# Altium schematic sheet 05_can_spi.SchDoc: =Proj_Title
size B; Address1: Giesshuebelstrasse 40; Address2: 8045 Zurich, Switzerland; SheetNumber: 5
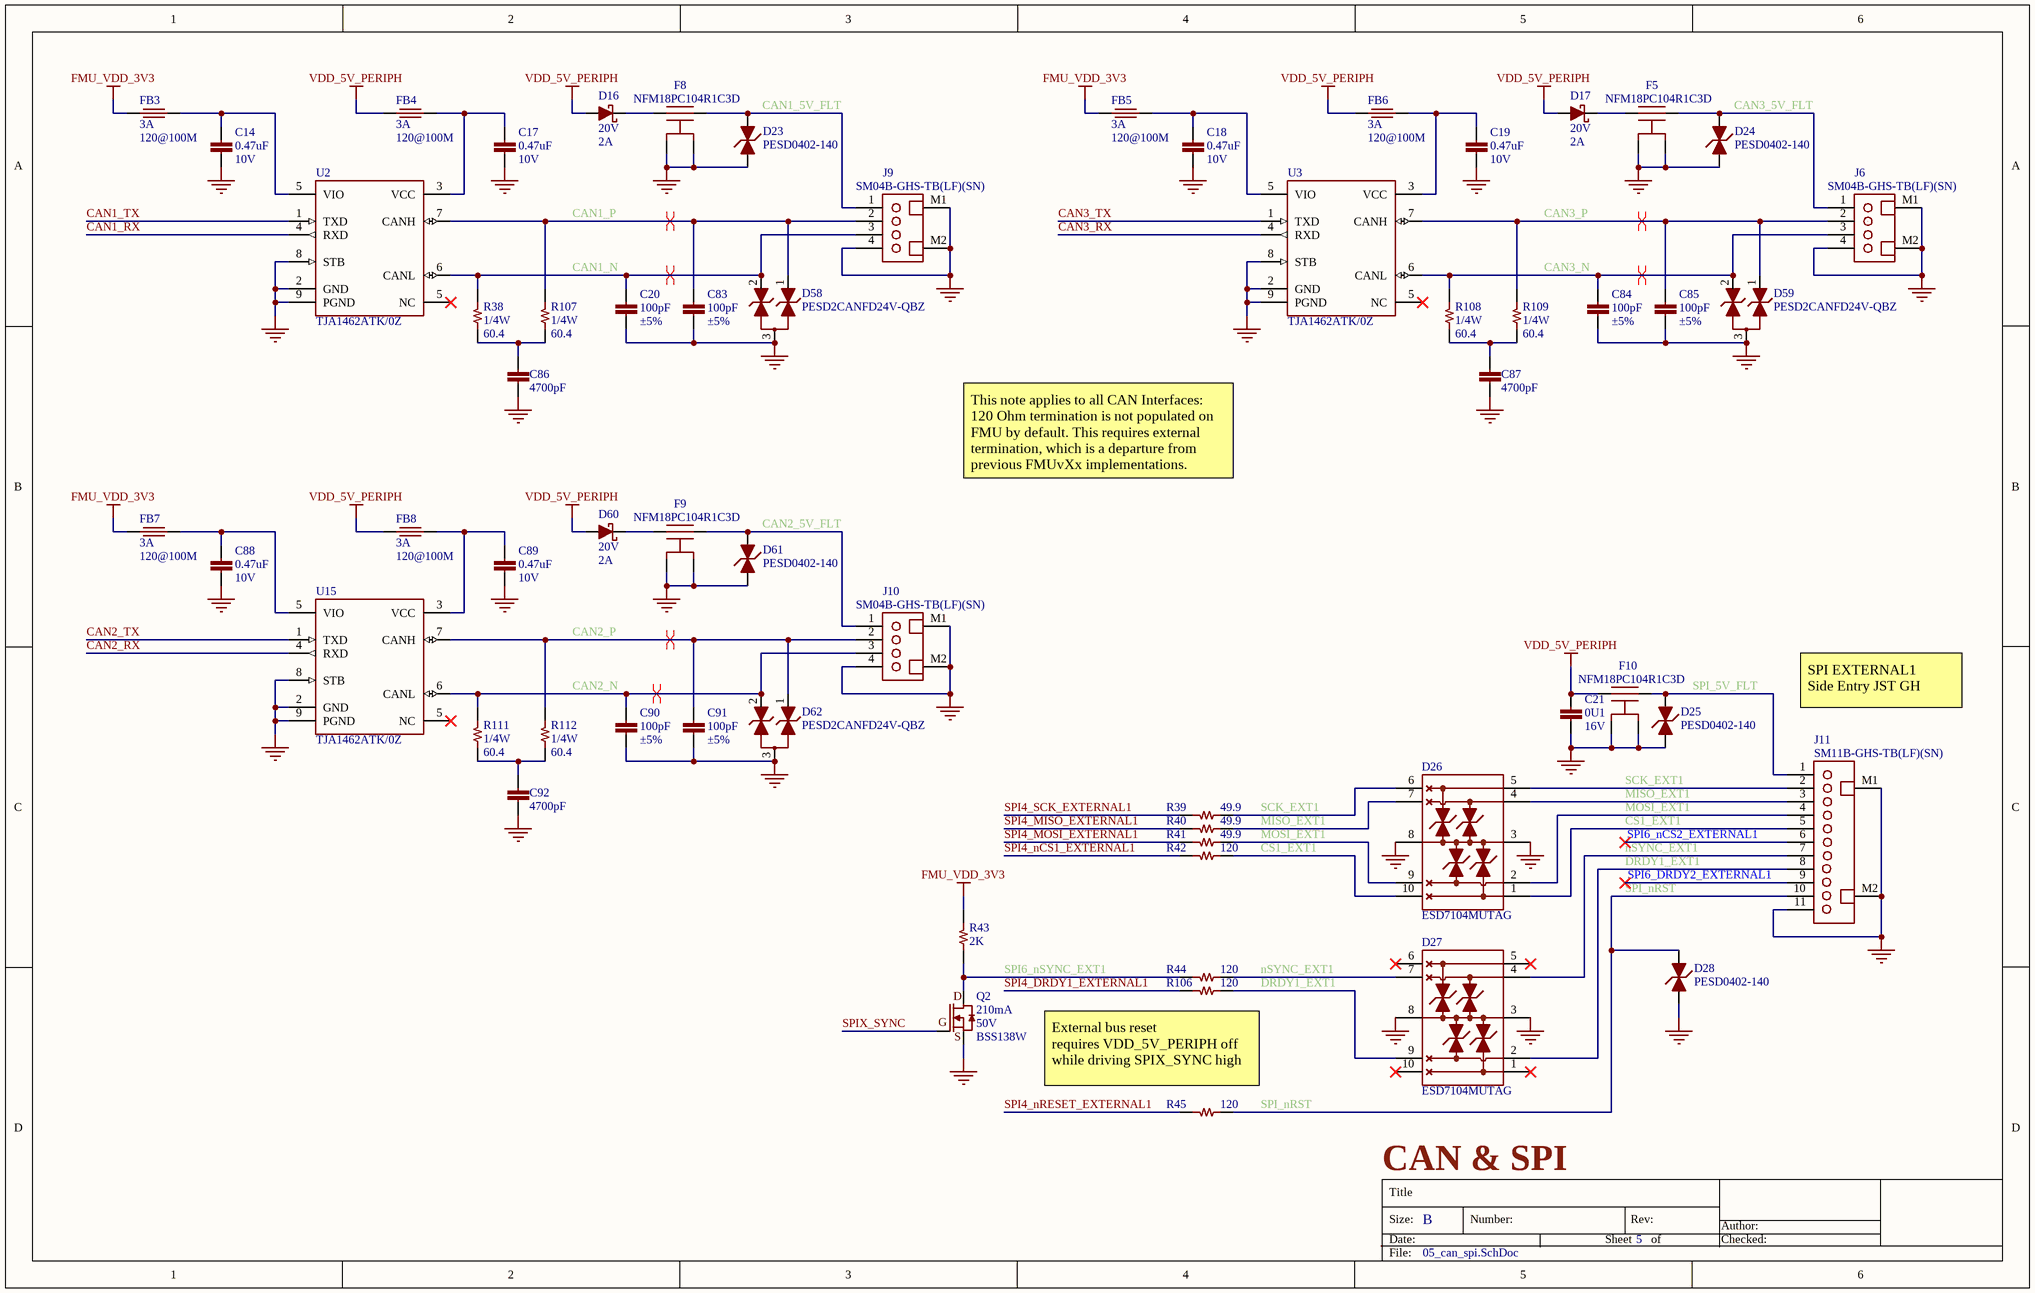
[diagram p0: 05_can_spi.SchDoc]

## Parts
C14  value 0.47uF  Voltage - Rated: 10V  [CAPC1608X90L30N]  (hidden comment: CAP CER 0.47UF 10% 10V X7R 0603)
C17  value 0.47uF  Voltage - Rated: 10V  [CAPC1608X90L30N]  (hidden comment: CAP CER 0.47UF 10% 10V X7R 0603)
C18  value 0.47uF  Voltage - Rated: 10V  [CAPC1608X90L30N]  (hidden comment: CAP CER 0.47UF 10% 10V X7R 0603)
C19  value 0.47uF  Voltage - Rated: 10V  [CAPC1608X90L30N]  (hidden comment: CAP CER 0.47UF 10% 10V X7R 0603)
C20  value 100pF  Tolerance: ±5%  [CAPC100X50X56L25N]  (hidden comment: CAP CER 100PF +/-5% 50V COG/NPO 0402)
C21  value 0U1  Voltage - Rated: 16V  [CAPC100X50X56L25N]  (hidden comment: CAP CER 0.1UF 10% 16V X7R 0402)
C83  value 100pF  Tolerance: ±5%  [CAPC100X50X56L25N]  (hidden comment: CAP CER 100PF +/-5% 50V COG/NPO 0402)
C84  value 100pF  Tolerance: ±5%  [CAPC100X50X56L25N]  (hidden comment: CAP CER 100PF +/-5% 50V COG/NPO 0402)
C85  value 100pF  Tolerance: ±5%  [CAPC100X50X56L25N]  (hidden comment: CAP CER 100PF +/-5% 50V COG/NPO 0402)
C86  value 4700pF  [CAPC100X50X56L25N]  (hidden comment: CAP CER 4700PF 10% 50V X7R 0402)
C87  value 4700pF  [CAPC100X50X56L25N]  (hidden comment: CAP CER 4700PF 10% 50V X7R 0402)
C88  value 0.47uF  Voltage - Rated: 10V  [CAPC1608X90L30N]  (hidden comment: CAP CER 0.47UF 10% 10V X7R 0603)
C89  value 0.47uF  Voltage - Rated: 10V  [CAPC1608X90L30N]  (hidden comment: CAP CER 0.47UF 10% 10V X7R 0603)
C90  value 100pF  Tolerance: ±5%  [CAPC100X50X56L25N]  (hidden comment: CAP CER 100PF +/-5% 50V COG/NPO 0402)
C91  value 100pF  Tolerance: ±5%  [CAPC100X50X56L25N]  (hidden comment: CAP CER 100PF +/-5% 50V COG/NPO 0402)
C92  value 4700pF  [CAPC100X50X56L25N]  (hidden comment: CAP CER 4700PF 10% 50V X7R 0402)
D16  Voltage: 20V  Current: 2A  [DIODFN2_160X80X40L34X71N]  (hidden comment: DIODE SCHOTTKY 20V 2A DFN1608D-2)
D17  Voltage: 20V  Current: 2A  [DIODFN2_160X80X40L34X71N]  (hidden comment: DIODE SCHOTTKY 20V 2A DFN1608D-2)
D23  Manufacturer Part Number: PESD0402-140  [DIONC100X50X43L20N]  (hidden comment: DIODE TVS BIDIRECTIONAL 14VWM 40VC 0402)
D24  Manufacturer Part Number: PESD0402-140  [DIONC100X50X43L20N]  (hidden comment: DIODE TVS BIDIRECTIONAL 14VWM 40VC 0402)
D25  Manufacturer Part Number: PESD0402-140  [DIONC100X50X43L20N]  (hidden comment: DIODE TVS BIDIRECTIONAL 14VWM 40VC 0402)
D26  Manufacturer Part Number: ESD7104MUTAG  [UDFN10P50_250X100X55L35X20N]  (hidden comment: DIODE TVS BIDIRECTIONAL 5V 10V 10UDFN)
D27  Manufacturer Part Number: ESD7104MUTAG  [UDFN10P50_250X100X55L35X20N]  (hidden comment: DIODE TVS BIDIRECTIONAL 5V 10V 10UDFN)
D28  Manufacturer Part Number: PESD0402-140  [DIONC100X50X43L20N]  (hidden comment: DIODE TVS BIDIRECTIONAL 14VWM 40VC 0402)
D58  Manufacturer Part Number: PESD2CANFD24V-QBZ  [NEXPERIA_SOT8015]  (hidden comment: DIODE TVS DUAL 42V CLAMP 2.6A (8/20us) DFN1110D-3)
D59  Manufacturer Part Number: PESD2CANFD24V-QBZ  [NEXPERIA_SOT8015]  (hidden comment: DIODE TVS DUAL 42V CLAMP 2.6A (8/20us) DFN1110D-3)
D60  Voltage: 20V  Current: 2A  [DIODFN2_160X80X40L34X71N]  (hidden comment: DIODE SCHOTTKY 20V 2A DFN1608D-2)
D61  Manufacturer Part Number: PESD0402-140  [DIONC100X50X43L20N]  (hidden comment: DIODE TVS BIDIRECTIONAL 14VWM 40VC 0402)
D62  Manufacturer Part Number: PESD2CANFD24V-QBZ  [NEXPERIA_SOT8015]  (hidden comment: DIODE TVS DUAL 42V CLAMP 2.6A (8/20us) DFN1110D-3)
F5  Manufacturer Part Number: NFM18PC104R1C3D  [NFM18PC104R1C3_0603_NO_VIA]  (hidden comment: FILTER CAP FEEDTHRU 0.1UF 20% 16V 0603)
F8  Manufacturer Part Number: NFM18PC104R1C3D  [NFM18PC104R1C3_0603_NO_VIA]  (hidden comment: FILTER CAP FEEDTHRU 0.1UF 20% 16V 0603)
F9  Manufacturer Part Number: NFM18PC104R1C3D  [NFM18PC104R1C3_0603_NO_VIA]  (hidden comment: FILTER CAP FEEDTHRU 0.1UF 20% 16V 0603)
F10  Manufacturer Part Number: NFM18PC104R1C3D  [NFM18PC104R1C3_0603_NO_VIA]  (hidden comment: FILTER CAP FEEDTHRU 0.1UF 20% 16V 0603)
FB3  value 120@100M  Current: 3A  [BEADC160X80X95L36N]  (hidden comment: IND FERRITE 120@100M 3A 20mOhm 0603)
FB4  value 120@100M  Current: 3A  [BEADC160X80X95L36N]  (hidden comment: IND FERRITE 120@100M 3A 20mOhm 0603)
FB5  value 120@100M  Current: 3A  [BEADC160X80X95L36N]  (hidden comment: IND FERRITE 120@100M 3A 20mOhm 0603)
FB6  value 120@100M  Current: 3A  [BEADC160X80X95L36N]  (hidden comment: IND FERRITE 120@100M 3A 20mOhm 0603)
FB7  value 120@100M  Current: 3A  [BEADC160X80X95L36N]  (hidden comment: IND FERRITE 120@100M 3A 20mOhm 0603)
FB8  value 120@100M  Current: 3A  [BEADC160X80X95L36N]  (hidden comment: IND FERRITE 120@100M 3A 20mOhm 0603)
J6  Manufacturer Part Number: SM04B-GHS-TB(LF)(SN)  [JST_SM04B-GHS-TBLFSN]  (hidden comment: CONN HEADER GH SIDE 4POS 1.25MM SMT)
J9  Manufacturer Part Number: SM04B-GHS-TB(LF)(SN)  [JST_SM04B-GHS-TBLFSN]  (hidden comment: CONN HEADER GH SIDE 4POS 1.25MM SMT)
J10  Manufacturer Part Number: SM04B-GHS-TB(LF)(SN)  [JST_SM04B-GHS-TBLFSN]  (hidden comment: CONN HEADER GH SIDE 4POS 1.25MM SMT)
J11  Manufacturer Part Number: SM11B-GHS-TB(LF)(SN)  [JST_SM11B-GHS-TBLFSN]  (hidden comment: CONN HEADER GH 11POS SIDE 1.25MM SMT)
Q2  Current: 210mA  Voltage: 50V  Manufacturer Part Number: BSS138W  [OnSemi_SC-70-3P65_210X110L20X32N]  (hidden comment: TRANSISTOR N-CH 50V .21A  SC-70)
R38  value 60.4  Power: 1/4W  [RESC1608X55L30N]  (hidden comment: RES 60.4 1% 1/4W 0603)
R39  value 49.9  [RESC100X50X40L25]  (hidden comment: RES SMD 49R9 OHM 1% 1/16W 0402)
R40  value 49.9  [RESC100X50X40L25]  (hidden comment: RES SMD 49R9 OHM 1% 1/16W 0402)
R41  value 49.9  [RESC100X50X40L25]  (hidden comment: RES SMD 49R9 OHM 1% 1/16W 0402)
R42  value 120  [RESC100X50X40L25]  (hidden comment: RES SMD 120 OHM 1% 1/16W 0402)
R43  value 2K  [RESC100X50X40L25]  (hidden comment: RES SMD 2K OHM 1% 1/16W 0402)
R44  value 120  [RESC100X50X40L25]  (hidden comment: RES SMD 120 OHM 1% 1/16W 0402)
R45  value 120  [RESC100X50X40L25]  (hidden comment: RES SMD 120 OHM 1% 1/16W 0402)
R106  value 120  [RESC100X50X40L25]  (hidden comment: RES SMD 120 OHM 1% 1/16W 0402)
R107  value 60.4  Power: 1/4W  [RESC1608X55L30N]  (hidden comment: RES 60.4 1% 1/4W 0603)
R108  value 60.4  Power: 1/4W  [RESC1608X55L30N]  (hidden comment: RES 60.4 1% 1/4W 0603)
R109  value 60.4  Power: 1/4W  [RESC1608X55L30N]  (hidden comment: RES 60.4 1% 1/4W 0603)
R111  value 60.4  Power: 1/4W  [RESC1608X55L30N]  (hidden comment: RES 60.4 1% 1/4W 0603)
R112  value 60.4  Power: 1/4W  [RESC1608X55L30N]  (hidden comment: RES 60.4 1% 1/4W 0603)
U2  Manufacturer Part Number: TJA1462ATK/0Z  [SON9P65_300X300X100L40X30T240X160_RECT_TABN]  (hidden comment: IC CAN TRANSCEIVER HALF 1/1 8-HVSON)
U3  Manufacturer Part Number: TJA1462ATK/0Z  [SON9P65_300X300X100L40X30T240X160_RECT_TABN]  (hidden comment: IC CAN TRANSCEIVER HALF 1/1 8-HVSON)
U15  Manufacturer Part Number: TJA1462ATK/0Z  [SON9P65_300X300X100L40X30T240X160_RECT_TABN]  (hidden comment: IC CAN TRANSCEIVER HALF 1/1 8-HVSON)

## Nets
FMU_VDD_3V3: FB3.1 FB5.1 FB7.1 R43.1
GND: C14.2 C17.2 C18.2 C19.2 C20.2 C21.2 C83.2 C84.2 C85.2 C86.2 C87.2 C88.2 C89.2 C90.2 C91.2 C92.2 D23.1 D24.1 D25.1 D26.3(GND) D26.8(GND) D27.3(GND) D27.8(GND) D28.1 D58.3 D59.3 D61.1 D62.3 F5.2A(GND) F5.2B(GND) F8.2A(GND) F8.2B(GND) F9.2A(GND) F9.2B(GND) F10.2A(GND) F10.2B(GND) J6.4 J6.M1 J6.M2 J9.4 J9.M1 J9.M2 J10.4 J10.M1 J10.M2 J11.11 J11.M1 J11.M2 Q2.S U2.2(GND) U2.8(STB) U2.9(PGND) U3.2(GND) U3.8(STB) U3.9(PGND) U15.2(GND) U15.8(STB) U15.9(PGND)
VDD_5V_PERIPH: C21.1 D16.A D17.A D60.A F10.1 FB4.1 FB6.1 FB8.1
CAN1_5V_FLT: D23.2 F8.3 J9.1
CAN1_N: C20.1 D58.2 J9.3 R38.1 U2.6(CANL)
CAN1_P: C83.1 D58.1 J9.2 R107.1 U2.7(CANH)
CAN1_RX: U2.4(RXD)
CAN1_TX: U2.1(TXD)
CAN2_5V_FLT: D61.2 F9.3 J10.1
CAN2_N: C90.1 D62.2 J10.3 R111.1 U15.6(CANL)
CAN2_P: C91.1 D62.1 J10.2 R112.1 U15.7(CANH)
CAN2_RX: U15.4(RXD)
CAN2_TX: U15.1(TXD)
CAN3_5V_FLT: D24.2 F5.3 J6.1
CAN3_N: C84.1 D59.2 J6.3 R108.1 U3.6(CANL)
CAN3_P: C85.1 D59.1 J6.2 R109.1 U3.7(CANH)
CAN3_RX: U3.4(RXD)
CAN3_TX: U3.1(TXD)
CS1_EXT1: D26.1 D26.10(NC) J11.5 R42.2
DRDY1_EXT1: D27.2 D27.9(NC) J11.8 R106.2
MISO_EXT1: D26.4 D26.7(NC) J11.3 R40.2
MOSI_EXT1: D26.2 D26.9(NC) J11.4 R41.2
nSYNC_EXT1: D27.4 D27.7(NC) J11.7 R44.2
SCK_EXT1: D26.5 D26.6(NC) J11.2 R39.2
SPI4_DRDY1_EXTERNAL1: R106.1
SPI4_MISO_EXTERNAL1: R40.1
SPI4_MOSI_EXTERNAL1: R41.1
SPI4_nCS1_EXTERNAL1: R42.1
SPI4_nRESET_EXTERNAL1: R45.1
SPI4_SCK_EXTERNAL1: R39.1
SPI6_nSYNC_EXT1: Q2.D R43.2 R44.1
SPI_5V_FLT: D25.2 F10.3 J11.1
SPI_nRST: D28.2 J11.10 R45.2
SPIX_SYNC: Q2.G
NetC14_1: C14.1 FB3.2 U2.5(VIO)
NetC17_1: C17.1 FB4.2 U2.3(VCC)
NetC18_1: C18.1 FB5.2 U3.5(VIO)
NetC19_1: C19.1 FB6.2 U3.3(VCC)
NetC86_1: C86.1 R38.2 R107.2
NetC87_1: C87.1 R108.2 R109.2
NetC88_1: C88.1 FB7.2 U15.5(VIO)
NetC89_1: C89.1 FB8.2 U15.3(VCC)
NetC92_1: C92.1 R111.2 R112.2
NetD16_C: D16.C F8.1
NetD17_C: D17.C F5.1
NetD60_C: D60.C F9.1

Not connected (* = marked no-connect by the designer): D27 1* 5* 6(NC)* 10(NC)*; J11 6* 9*

## Layout directives
differential pair: CAN1_N, CAN1_P, CAN2_N, CAN2_P, CAN3_N, CAN3_P

## Notes on the sheet
- This note applies to all CAN Interfaces:
  120 Ohm termination is not populated on FMU by default. This requires external termination, which is a departure from previous FMUvXx implementations.
- SPI EXTERNAL1
  Side Entry JST GH
- SPI6_nCS2_EXTERNAL1
- (near J11) SPI6_DRDY2_EXTERNAL1
- External bus reset
  requires VDD_5V_PERIPH off
  while driving SPIX_SYNC high
- CAN & SPI
- Title
- Size:
- Date:
- B
- Number:
- Sheet
- Rev:
- of
- Author:
- Checked:
- File:

## Library data of the parts
C14 C17-C19 C88 C89 = CAP_0U47_10V_X7R_0603: Manufacturer: Samsung Electro-Mechanics; Manufacturer Part Number: CL10B474KP8NNNC; Packaging: Cut Tape (CT); Part Status: Active; Tolerance: ±10%; Operating Temperature: -55°C ~ 125°C; Supplier 1: Digi-Key; Supplier Part Number 1: 1276-1247-1-ND; Category: Capacitors; Stock 1: 40000; Pricing 1: 1=0.1, 10=0.065, 100=0.0292, 500=0.02082, 1000=0.01637, 2500=0.01488, 5000=0.01369 (USD); ComponentLink1Description: https://www.digikey.com/product-detail/en/samsung-electro-mechanics/CL10B474KP8NNNC/1276-1247-1-ND/3889333; ComponentLink1URL: https://www.digikey.com/product-detail/en/samsung-electro-mechanics/CL10B474KP8NNNC/1276-1247-1-ND/3889333
C20 C83-C85 C90 C91 = CAP_100PF_50V_COG/NPO_0402: Manufacturer: Murata Electronics; Manufacturer Part Number: GRM1555C1H101JA01D; Packaging: Tape & Reel (TR); Part Status: Active; Operating Temperature: -55°C ~ 125°C; Supplier 1: Digi-Key; Supplier Part Number 1: 490-5922-1-ND; Category: Capacitors; Stock 1: 11490608; Pricing 1: 1=0.1 (USD); Voltage - Rated: 50V; ComponentLink1Description: https://www.digikey.com/en/products/detail/murata-electronics/GRM1555C1H101JA01D/3721279; ComponentLink1URL: https://www.digikey.com/en/products/detail/murata-electronics/GRM1555C1H101JA01D/3721279
C21 = CAP_0U1_16V_X7R_0402: Manufacturer: Murata Electronics; Manufacturer Part Number: GCM155R71C104KA55J; Packaging: Cut Tape (CT); Part Status: Active; Tolerance: ±10%; Operating Temperature: -55°C ~ 125°C; Supplier 1: Digi-Key; Supplier Part Number 1: 490-7998-1-ND; Category: Capacitors; Stock 1: 6381653; Pricing 1: 1=0.1, 10=0.049, 100=0.022, 500=0.0157, 1000=0.01233, 2500=0.01121, 5000=0.01032 (USD); ComponentLink1Description: https://www.digikey.com/product-detail/en/murata-electronics/GCM155R71C104KA55J/490-7998-1-ND/4380283; ComponentLink1URL: https://www.digikey.com/product-detail/en/murata-electronics/GCM155R71C104KA55J/490-7998-1-ND/4380283
C86 C87 C92 = CAP_4700PF_5%_50V_X7R_0402: Manufacturer: Murata Electronics; Manufacturer Part Number: GRM155R71H472KA01J; Packaging: Cut Tape (CT); Part Status: Active; Temperature Coefficient: X7R; Operating Temperature: -55°C ~ 125°C; Ratings: -; Supplier 1: Digi-Key; Supplier Part Number 1: 490-8259-1-ND; Category: Capacitors; Stock 1: 457897; Pricing 1: 1=0.1, 10=0.011, 100=0.005, 500=0.00354, 1000=0.00278, 2500=0.00253, 5000=0.00233 (USD); Voltage - Rated: 50V; ComponentLink1Description: https://www.digikey.com/en/products/detail/murata-electronics/GRM155R71H472KA01J/2610945; ComponentLink1URL: https://www.digikey.com/en/products/detail/murata-electronics/GRM155R71H472KA01J/2610945; Tolerance: ±10%
D16 D17 D60 = DIODE_SCHOTTKY_20V_2A_DFN1608D-2: Manufacturer: Nexperia USA Inc.; Manufacturer Part Number: PMEG2020EPK,315; Packaging: Cut Tape (CT); Part Status: Active; Supplier 1: Digi-Key; Supplier Part Number 1: 1727-1338-1-ND; Category: Discrete Semiconductor Products; Stock 1: 0; Pricing 1: 1=0.51 (USD); ComponentLink1Description: https://www.digikey.com/en/products/detail/nexperia-usa-inc/PMEG2020EPK-315/4020972; ComponentLink1URL: https://www.digikey.com/en/products/detail/nexperia-usa-inc/PMEG2020EPK-315/4020972
D23-D25 D28 D61 = DIODE_TVS_0402: Manufacturer: Littelfuse Inc.; Packaging: Cut Tape (CT); Part Status: Active; Operating Temperature: -55°C ~ 125°C (TJ); ComponentLink1URL: https://www.digikey.com/products/en/circuit-protection/tvs-diodes/144?k=PESD0402-140&k=&pkeyword=PESD0402-140&pv7=2&sf=0&quantity=&ColumnSort=0&page=1&pageSize=25; ComponentLink1Description: https://www.digikey.com/products/en/circuit-protection/tvs-diodes/144?k=PESD0402-140&k=&pkeyword=PESD0402-140&pv7=2&sf=0&quantity=&ColumnSort=0&page=1&pageSize=25; Supplier 1: Digi-Key; Supplier Part Number 1: PESD0402-140CT-ND; Category: Circuit Protection; Stock 1: 281442; Pricing 1: 10000=0.13154, 30000=0.12096 (USD)
D26 D27 = DIODE_TVS_4X_10UDFN: Manufacturer: ON Semiconductor; Packaging: Cut Tape (CT); Part Status: Active; Operating Temperature: -55°C ~ 125°C (TJ); Supplier 1: Digi-Key; Supplier Part Number 1: ESD7104MUTAGOSCT-ND; Category: Circuit Protection; Stock 1: 5750; Pricing 1: 1=0.63, 10=0.541, 100=0.40370, 500=0.31716, 1000=0.24508 (USD); ComponentLink1Description: https://www.digikey.com/product-detail/en/on-semiconductor/ESD7104MUTAG/ESD7104MUTAGOSCT-ND/3487538; ComponentLink1URL: https://www.digikey.com/product-detail/en/on-semiconductor/ESD7104MUTAG/ESD7104MUTAGOSCT-ND/3487538
D58 D59 D62 = DIODE_TVS_DUAL_24VWM_42VC_DFN1110D-3: Manufacturer: Nexperia USA Inc.; Packaging: Cut Tape (CT); Part Status: Active; Supplier 1: Digi-Key; Supplier Part Number 1: 1727-PESD2CANFD24V-QBZCT-ND; Category: Discrete Semiconductor Products; Stock 1: 11955; Pricing 1: 1=0.44 (USD); Current: 2.6A; Voltage: 42V; ComponentLink1Description: https://www.digikey.com/en/products/detail/nexperia-usa-inc/PESD2CANFD24V-QBZ/13898295?s=N4IgTCBcDaIAoFEDKARMBhAggOQGJoBYA1AWgEUAhEAXQF8g; ComponentLink1URL: https://www.digikey.com/en/products/detail/nexperia-usa-inc/PESD2CANFD24V-QBZ/13898295?s=N4IgTCBcDaIAoFEDKARMBhAggOQGJoBYA1AWgEUAhEAXQF8g
F5 F8-F10 = FILTER_0.1uF_16V_2A_NO_VIA_0603: Manufacturer: Murata Electronics North America; Packaging: Cut Tape (CT); Part Status: Active; Tolerance: ±20%; Voltage - Rated: 16V; Operating Temperature: -55°C ~ 125°C; Supplier 1: Digi-Key; Supplier Part Number 1: 490-6969-1-ND; Category: Filters; Stock 1: 172860; Pricing 1: 1=0.19, 10=0.173, 25=0.1652, 50=0.1598, 100=0.1544, 250=0.1464, 500=0.12246, 1000=0.09503 (USD); ComponentLink1Description: https://www.digikey.com/products/en/filters/feed-through-capacitors/845?k=NFM18PC104R1C3D&k=&pkeyword=NFM18PC104R1C3D&pv7=2&sf=0&quantity=&ColumnSort=0&page=1&pageSize=25; ComponentLink1URL: https://www.digikey.com/products/en/filters/feed-through-capacitors/845?k=NFM18PC104R1C3D&k=&pkeyword=NFM18PC104R1C3D&pv7=2&sf=0&quantity=&ColumnSort=0&page=1&pageSize=25
FB3-FB8 = IND_FERRITE_120@100M_3A_0603: Manufacturer: Murata Electronics; Manufacturer Part Number: BLM18KG121TZ1D; Packaging: Cut Tape (CT); Part Status: Active; Operating Temperature: -55°C ~ 125°C; Supplier 1: Digi-Key; Supplier Part Number 1: 490-16500-1-ND; Category: Inductors; Stock 1: 0; Pricing 1: 1=0.11 (USD); ComponentLink1Description: https://www.digikey.com/en/products/detail/murata-electronics/BLM18KG121TZ1D/7363244?s=N4IgTCBcDaIEYBsC2BGAHAawOYrCgLgF4ogC6AvkA; ComponentLink1URL: https://www.digikey.com/en/products/detail/murata-electronics/BLM18KG121TZ1D/7363244?s=N4IgTCBcDaIEYBsC2BGAHAawOYrCgLgF4ogC6AvkA
J6 J9 J10 = CONN_JST_GH_4PIN_RA_SMT: Manufacturer: JST Sales America Inc.; Voltage Rating: 50V; System: Connector; Packaging: Cut Tape (CT); Part Status: Active; Operating Temperature: -25°C ~ 85°C; Supplier 1: Digi-Key; Supplier Part Number 1: 455-1566-1-ND; Category: Connectors, Interconnects; Stock 1: 109892; Pricing 1: 1=0.45, 10=0.423, 100=0.3244, 500=0.28212, 1000=0.23274 (USD); ComponentLink1Description: https://www.digikey.com/products/en/connectors-interconnects/rectangular-connectors-headers-male-pins/314?k=SM04B-GHS-TB%28LF%29%28SN%29-&k=&pkeyword=SM04B-GHS-TB%28LF%29%28SN%29-&pv7=2&sf=0&quantity=&ColumnSort=0&page=1&pageSize=25; ComponentLink1URL: https://www.digikey.com/products/en/connectors-interconnects/rectangular-connectors-headers-male-pins/314?k=SM04B-GHS-TB%28LF%29%28SN%29-&k=&pkeyword=SM04B-GHS-TB%28LF%29%28SN%29-&pv7=2&sf=0&quantity=&ColumnSort=0&page=1&pageSize=25
J11 = CONN_JST_GH_11PIN_RA_SMT: Manufacturer: JST Sales America Inc.; Voltage - Rated: 50V; System: Connector; Packaging: Cut Tape (CT); Part Status: Active; Operating Temperature: -25°C ~ 85°C; Supplier 1: Digi-Key; Supplier Part Number 1: 455-1573-1-ND; Category: Connectors, Interconnects; Stock 1: 659; Pricing 1: 1=0.67, 10=0.631, 100=0.4838, 500=0.42068, 1000=0.34705 (USD); ComponentLink1Description: https://www.digikey.com/products/en/connectors-interconnects/rectangular-connectors-headers-male-pins/314?k=sm11b-ghs&k=&pkeyword=sm11b-ghs&pv7=2&sf=0&quantity=&ColumnSort=0&page=1&pageSize=25; ComponentLink1URL: https://www.digikey.com/products/en/connectors-interconnects/rectangular-connectors-headers-male-pins/314?k=sm11b-ghs&k=&pkeyword=sm11b-ghs&pv7=2&sf=0&quantity=&ColumnSort=0&page=1&pageSize=25
Q2 = TRAN_MOSFET_N-CH_BSS138W_SMT: Manufacturer: ON Semiconductor; Packaging: Cut Tape (CT); Part Status: Active; Supplier 1: Digi-Key; Supplier Part Number 1: BSS138WCT-ND; Category: Discrete Semiconductor Products; Stock 1: 2599; Pricing 1: 1=0.43 (USD); ComponentLink1Description: https://www.digikey.com/product-detail/en/on-semiconductor/BSS138W/BSS138WCT-ND/3907886; ComponentLink1URL: https://www.digikey.com/product-detail/en/on-semiconductor/BSS138W/BSS138WCT-ND/3907886
R38 R107-R109 R111 R112 = RES_60.4_1%_1/4W_0603: Manufacturer: Vishay Dale; Manufacturer Part Number: RCS060360R4FKEA; Packaging: Digi-Reel®; Part Status: Active; Tolerance: ±1%; Operating Temperature: -55°C ~ 155°C; Supplier 1: Digi-Key; Supplier Part Number 1: 541-10484-1-ND; Category: Resistors; Stock 1: 6966; Pricing 1: 1=0.15 (USD); ComponentLink1Description: https://www.digikey.com/en/products/detail/vishay-dale/RCS060360R4FKEA/5868350; ComponentLink1URL: https://www.digikey.com/en/products/detail/vishay-dale/RCS060360R4FKEA/5868350
R39-R41 = RES_49.9_1%_1/16W_0402: Manufacturer: Yageo; Manufacturer Part Number: RC0402FR-0749R9L; Packaging: Cut Tape (CT); Part Status: Active; Tolerance: ±1%; Operating Temperature: -55°C ~ 155°C; Supplier 1: Digi-Key; Supplier Part Number 1: 311-49.9LRCT-ND; Category: Resistors; Stock 1: 21141499; Pricing 1: 1=0.1, 10=0.014, 100=0.0056, 1000=0.00253, 2500=0.0022, 5000=0.00181 (USD); Power: 1/16W; ComponentLink1Description: https://www.digikey.com/product-detail/en/yageo/RC0402FR-0749R9L/311-49.9LRCT-ND/729568; ComponentLink1URL: https://www.digikey.com/product-detail/en/yageo/RC0402FR-0749R9L/311-49.9LRCT-ND/729568
R42 R44 R45 R106 = RES_120_1%_1/16W_0402: Manufacturer: Yageo; Manufacturer Part Number: RC0402FR-07120RL; Category: Resistors; Packaging: Cut Tape (CT); Part Status: Active; Tolerance: ±1%; Operating Temperature: -55°C ~ 155°C; Supplier 1: Digi-Key; Supplier Part Number 1: 311-120LRCT-ND; Stock 1: 607269; Pricing 1: 1=0.1, 10=0.014, 100=0.0056, 1000=0.00253, 2500=0.0022, 5000=0.00181 (USD); Power: 1/16W; ComponentLink1Description: https://www.digikey.com/products/en/resistors/chip-resistor-surface-mount/52?k=RC0402FR-07120RL&k=&pkeyword=RC0402FR-07120RL&pv7=2&sf=0&quantity=&ColumnSort=0&page=1&pageSize=25; ComponentLink1URL: https://www.digikey.com/products/en/resistors/chip-resistor-surface-mount/52?k=RC0402FR-07120RL&k=&pkeyword=RC0402FR-07120RL&pv7=2&sf=0&quantity=&ColumnSort=0&page=1&pageSize=25
R43 = RES_2K_1%_1/16W_0402: Manufacturer: Yageo; Manufacturer Part Number: RC0402FR-072KL; Packaging: Cut Tape (CT); Part Status: Active; Tolerance: ±1%; Operating Temperature: -55°C ~ 155°C; Supplier 1: Digi-Key; Supplier Part Number 1: 311-2KLRCT-ND; Category: Resistors; Stock 1: 18685853; Pricing 1: 1=0.1, 10=0.014, 100=0.0056, 1000=0.00253, 2500=0.0022, 5000=0.00181 (USD); Power: 1/16W; ComponentLink1Description: https://www.digikey.com/product-detail/en/yageo/RC0402FR-072KL/311-2KLRCT-ND/2827883; ComponentLink1URL: https://www.digikey.com/product-detail/en/yageo/RC0402FR-072KL/311-2KLRCT-ND/2827883
U2 U3 U15 = IC_TJA1462ATK/0Z_8-HVSON: Manufacturer: NXP USA Inc.; Packaging: Tape & Reel (TR); Part Status: Active; Operating Temperature: -40°C ~ 150°C; Supplier 1: Digi-Key; Supplier Part Number 1: 568-TJA1462ATK/0ZCT-ND; Category: Integrated Circuits (ICs); Stock 1: 0; Pricing 1: 1=1.57 (USD); ComponentLink1Description: https://www.digikey.com/en/products/detail/nxp-usa-inc/TJA1462ATK-0Z/13590298?s=N4IgTCBcDaICoCkCCBGALANjEuBpA9AAwBaIAugL5A; ComponentLink1URL: https://www.digikey.com/en/products/detail/nxp-usa-inc/TJA1462ATK-0Z/13590298?s=N4IgTCBcDaICoCkCCBGALANjEuBpA9AAwBaIAugL5A